# EAGLE design dsn-hat (EAGLE 9.5.1)
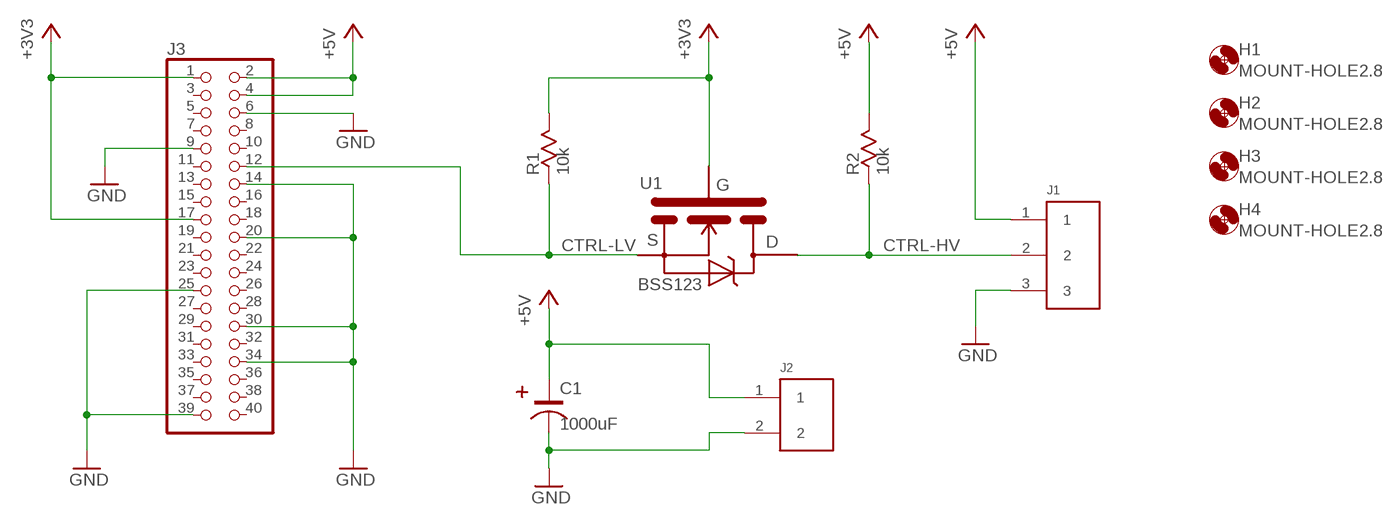
[diagram p0: schematic, sheet 1]

## Parts
C1  1000uF  CAP-E-THCAP-TH  [CAP-TH]
H1  MOUNT-HOLE2.8  [2,8]
H2  MOUNT-HOLE2.8  [2,8]
H3  MOUNT-HOLE2.8  [2,8]
H4  MOUNT-HOLE2.8  [2,8]
J1  TERM-TH-3TERM-TH-3  [TERM-TH-3]
J2  TERM-TH-2TH2  [TERM-TH-2]
J3  PINHD-2X20  [2X20]
R1  10k  R08050805  [R0805]
R2  10k  R08050805  [R0805]
U1  BSS123  BSS123BSS123-SOT23  [SOT23]

## Nets
+3V3: J3.1 J3.17 R1.1 U1.1(G)
+5V: C1.POS J1.1 J2.1 J3.2 J3.4 R2.1
CTRL-HV: J1.2 R2.2 U1.3(D)
CTRL-LV: J3.12 R1.2 U1.2(S)
GND: C1.NEG J1.3 J2.2 J3.6 J3.9 J3.14 J3.20 J3.25 J3.30 J3.34 J3.39
Unconnected: J3.3 J3.5 J3.7 J3.8 J3.10 J3.11 J3.13 J3.15 J3.16 J3.18 J3.19 J3.21 J3.22 J3.23 J3.24 J3.26 J3.27 J3.28 J3.29 J3.31 J3.32 J3.33 J3.35 J3.36 J3.37 J3.38 J3.40

## Library data of the parts
C1 = dsn_art:CAP-E-TH: Through-hole radial electrolytic capacitor, bent on its side
H1-H4 = holes:MOUNT-HOLE: MOUNTING HOLE with drill center marker
J1 = dsn_art:TERM-TH-3
J2 = dsn_art:TERM-TH-2
J3 = pinhead:PINHD-2X20: PIN HEADER
R1 R2 = dsn_art:R0805: Resistor in 0805 package
U1 = dsn_art:BSS123: BSS123 logic level enhancement FET in SOT-23-3 package

## Board
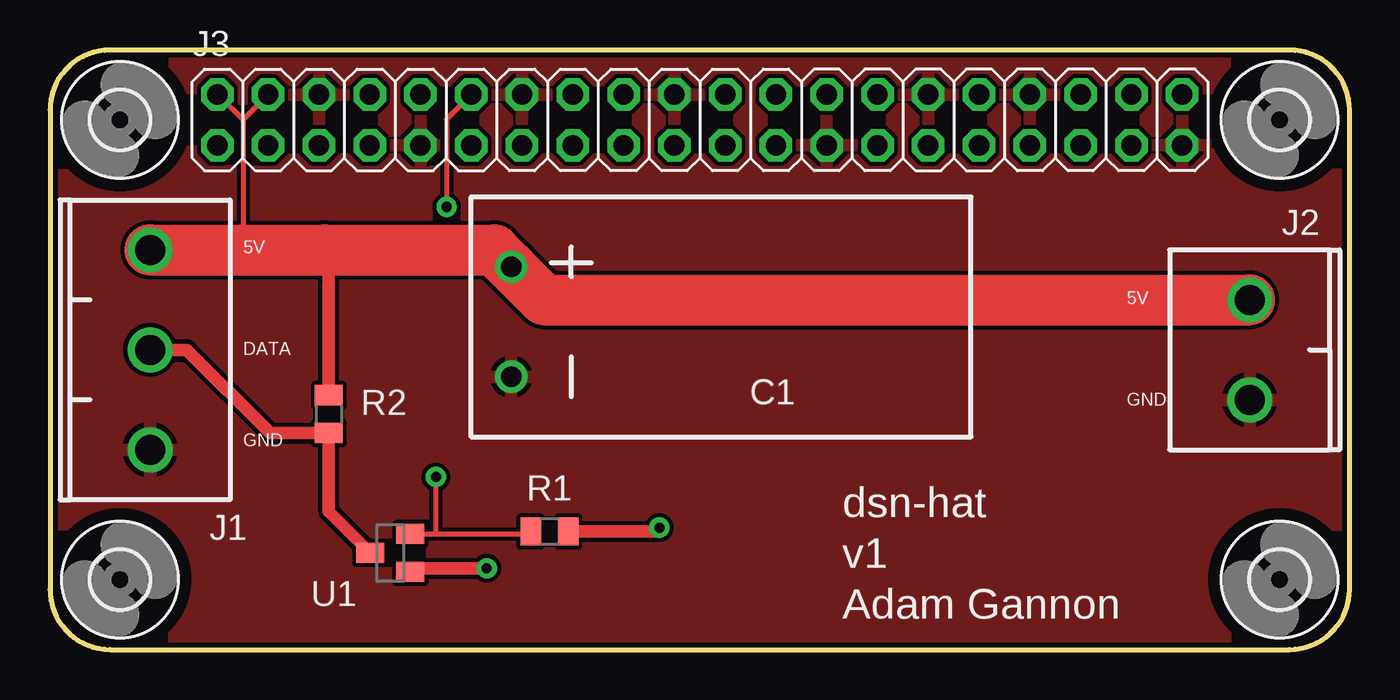
[diagram p1: board, top side]
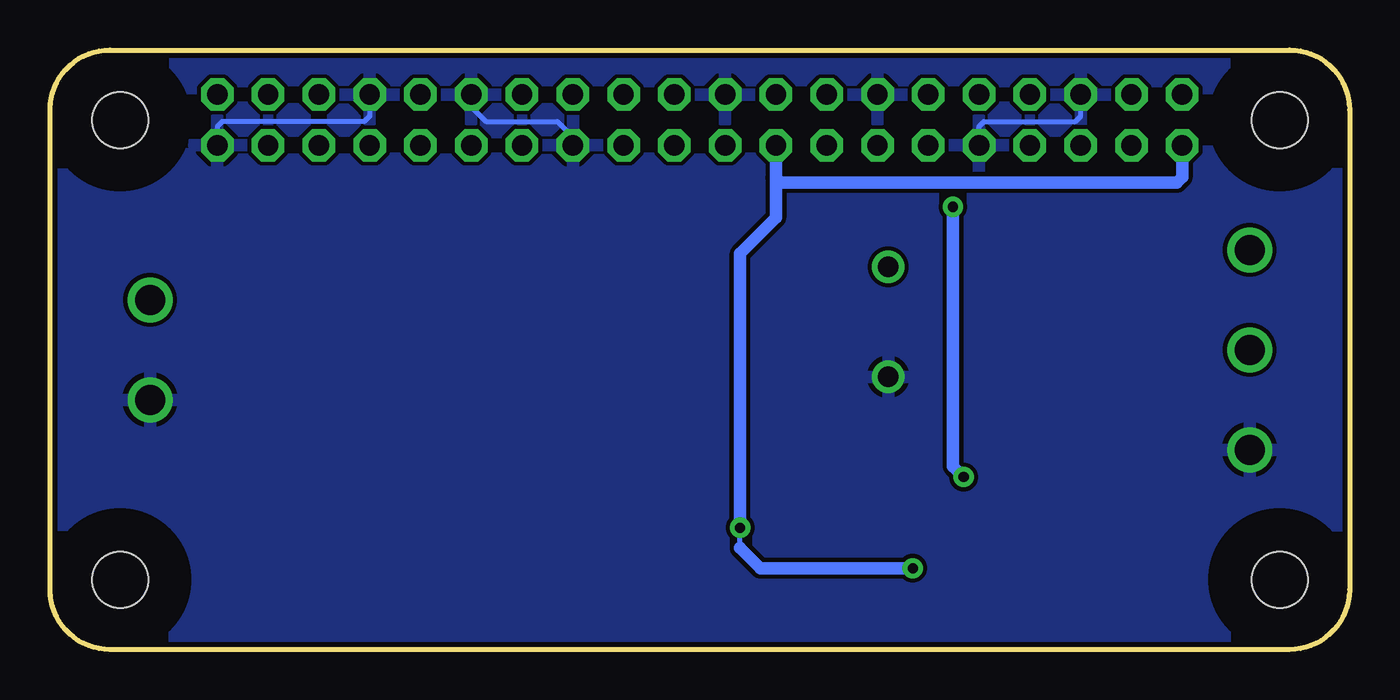
[diagram p2: board, bottom side, seen from below]

Size 65 x 30 mm. Coordinates in mm from the lower left corner, seen from the top.
Outline: 0,27 0,3 arc90 3,0 62,0 arc90 65,3 65,27 arc90 62,30 3,30 arc90 0,27
Copper layers (1*16): Top 0.035mm / dielectric 1.5mm / Bottom 0.035mm
Design rules "SparkFun": minimum track width 8mil, minimum drill 20mil, track to track 8mil, track to pad 8mil, pad to pad 8mil, via to via 8mil, smd to smd 8mil, copper to edge 10mil, drill to drill 8mil, minimum pad ring 12mil, minimum via ring 10mil, stop-mask expansion 4mil, vias tented up to drill 25mil, thermal gap 10mil

### Footprints (pad centres in the part's own frame; a part is rotated, then mirrored left to right if it is on the bottom)
CAP-TH = drill 1.016: NEG 0,0; POS 5.5,0
2,8 = hole 2.8: 0,0
TERM-TH-3 = drill 1.5: 1 0,0; 2 0,-5; 3 0,-10
TERM-TH-2 = drill 1.5: 1 0,-5; 2 0,0
2X20 = drill 1.016 octagon: 1 -24.13,-1.27; 2 -24.13,1.27; 3 -21.59,-1.27; 4 -21.59,1.27; 5 -19.05,-1.27; 6 -19.05,1.27; 7 -16.51,-1.27; 8 -16.51,1.27; 9 -13.97,-1.27; 10 -13.97,1.27; 11 -11.43,-1.27; 12 -11.43,1.27; 13 -8.89,-1.27; 14 -8.89,1.27; 15 -6.35,-1.27; 16 -6.35,1.27; 17 -3.81,-1.27; 18 -3.81,1.27; 19 -1.27,-1.27; 20 -1.27,1.27; 21 1.27,-1.27; 22 1.27,1.27; 23 3.81,-1.27; 24 3.81,1.27; 25 6.35,-1.27; 26 6.35,1.27; 27 8.89,-1.27; 28 8.89,1.27; 29 11.43,-1.27; 30 11.43,1.27; 31 13.97,-1.27; 32 13.97,1.27; 33 16.51,-1.27; 34 16.51,1.27; 35 19.05,-1.27; 36 19.05,1.27; 37 21.59,-1.27; 38 21.59,1.27; 39 24.13,-1.27; 40 24.13,1.27
R0805 = smd 1.02 x 1.4: 1 -0.94,0; 2 0.94,0
SOT23 = smd 1 x 1.4: 1 -0.95,-1; 2 0.95,-1; 3 0,1

### Placement (x,y rotation side)
C1  23.07,13.64 90 top
H1  3.5,3.5 0 top
H2  3.5,26.5 0 top
H3  61.5,3.5 0 top
H4  61.5,26.5 0 top
J1  5,20 0 top
J2  60,12.5 180 top
J3  32.5,26.5 0 top
R1  24.98,5.91 180 top
R2  13.94,11.78 270 top
U1  17.02,4.83 90 top

### Tracks (layer width: path | path; a pad name or v marks a point on that pad's centre or on a via)
+3V3  (via drill 0.51)
  Top 0.635: R1.1 30.29,5.91 v30.48,6.1 | U1.1 18.02,4.06 v21.84,4.06
  Bottom 0.254: 30.48,5.08 v30.48,6.1
  Bottom 0.635: v30.48,6.1 30.48,19.81 28.69,21.6 28.69,23.61 | J3.17 28.69,23.61 | 28.69,23.61 28.45,23.37 8.64,23.37 8.37,23.63 J3.1 | v21.84,4.06 29.46,4.06 30.48,5.08
+5V
  Top 0.254: J3.4 9.65,26.51 | 9.65,26.51 9.65,20 | 8.39,27.77 9.65,26.51
  Top 0.635: R2.1 13.94,19.77 13.72,20 | J3.2 8.39,27.77
  Top 2.54: J1.1 9.65,20 13.72,20 22.22,20 C1.POS 24.72,17.5 J2.1
CTRL-HV
  Top 0.635: J1.2 6.84,15 11.01,10.84 R2.2 13.94,6.91 U1.3
CTRL-LV  (via drill 0.51)
  Top 0.254: U1.2 19.3,5.78 | 19.3,5.78 23.92,5.78 | 19.3,5.78 v19.3,8.64 | J3.12 19.84,26.54 v19.84,22.15
  Top 0.508: 23.92,5.78 R1.2
  Bottom 0.635: v19.84,22.15 19.84,9.17 v19.3,8.64
GND
  Bottom 0.254: J3.30 43.93,27.17 43.18,26.42 39.62,26.42 38.85,25.64 J3.25 | J3.34 49.01,26.68 49.28,26.42 56.39,26.42 56.63,26.17 J3.39 | J3.9 18.53,26.17 18.29,26.42 13.72,26.42 13.45,26.68 J3.6
  pour Top: 0,0 0,29.97 65.02,29.97 65.02,28.96 65.02,0 64.52,0
  pour Bottom: 0,0 0,29.97 65.02,29.97 65.02,0

### Text on the board
tPlace: 5V | 5V | DATA | GND | GND | dsn-hat | v1 | Adam Gannon